# EAGLE schematic PGTNX01_teensy (EAGLE 8.5.2)
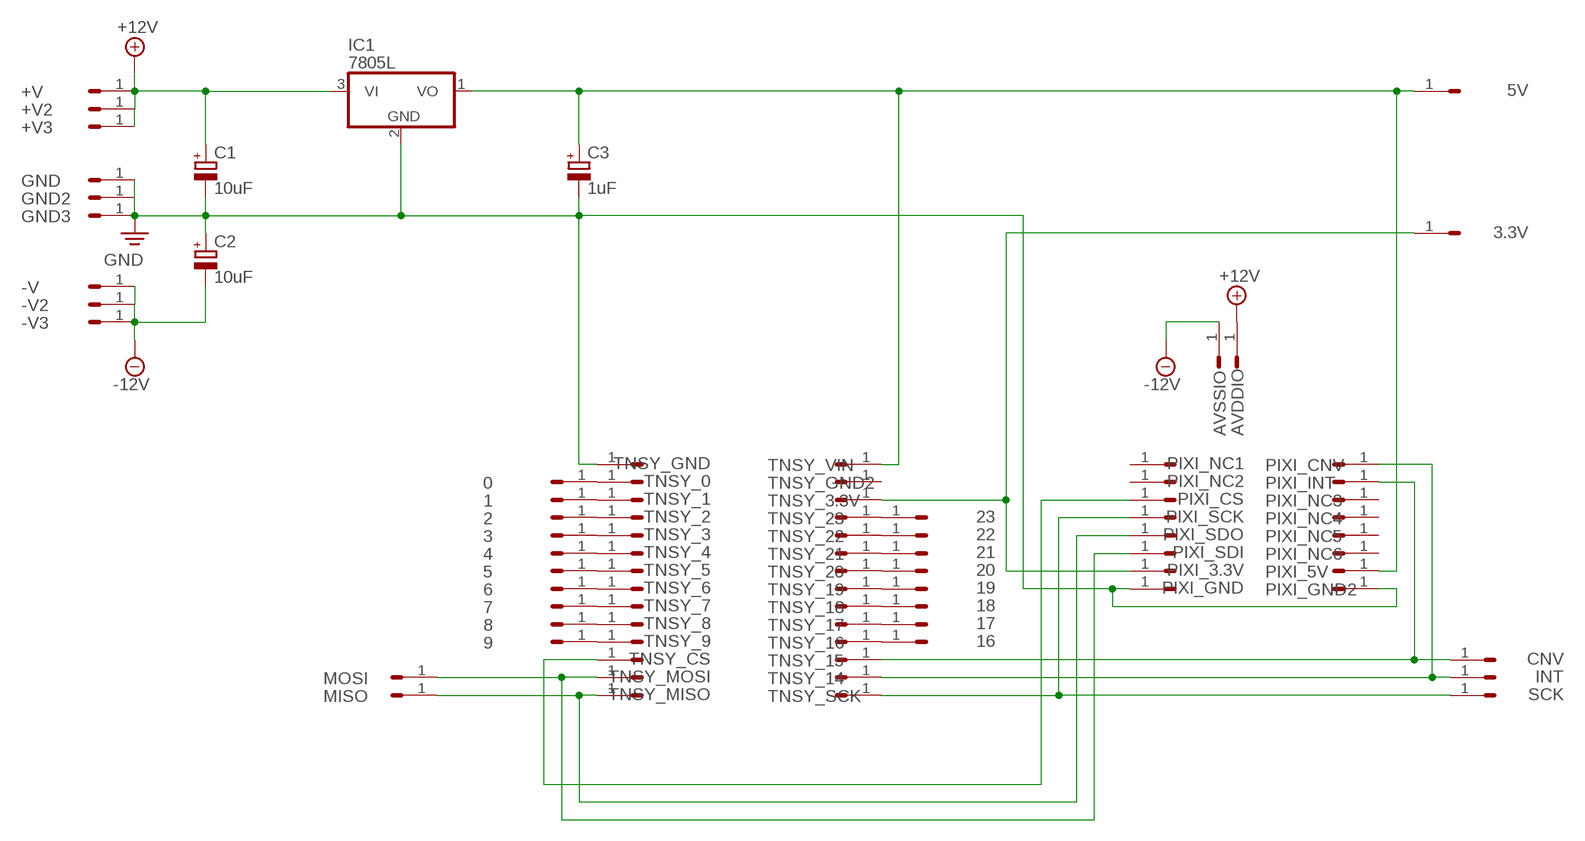
[diagram p0: schematic, sheet 1]

## Parts
0  HEADER/MALE/01  [HEADER/MALE/01]
1  HEADER/MALE/01  [HEADER/MALE/01]
2  HEADER/MALE/01  [HEADER/MALE/01]
3  HEADER/MALE/01  [HEADER/MALE/01]
3.3V  HEADER/MALE/01  [HEADER/MALE/01]
4  HEADER/MALE/01  [HEADER/MALE/01]
5  HEADER/MALE/01  [HEADER/MALE/01]
5V  HEADER/MALE/01  [HEADER/MALE/01]
6  HEADER/MALE/01  [HEADER/MALE/01]
7  HEADER/MALE/01  [HEADER/MALE/01]
8  HEADER/MALE/01  [HEADER/MALE/01]
9  HEADER/MALE/01  [HEADER/MALE/01]
16  HEADER/MALE/01  [HEADER/MALE/01]
17  HEADER/MALE/01  [HEADER/MALE/01]
18  HEADER/MALE/01  [HEADER/MALE/01]
19  HEADER/MALE/01  [HEADER/MALE/01]
20  HEADER/MALE/01  [HEADER/MALE/01]
21  HEADER/MALE/01  [HEADER/MALE/01]
22  HEADER/MALE/01  [HEADER/MALE/01]
23  HEADER/MALE/01  [HEADER/MALE/01]
+V  HEADER/MALE/01  [HEADER/MALE/01]
+V2  HEADER/MALE/01  [HEADER/MALE/01]
+V3  HEADER/MALE/01  [HEADER/MALE/01]
-V  HEADER/MALE/01  [HEADER/MALE/01]
-V2  HEADER/MALE/01  [HEADER/MALE/01]
-V3  HEADER/MALE/01  [HEADER/MALE/01]
AVDDIO  HEADER/MALE/01  [HEADER/MALE/01]
AVSSIO  HEADER/MALE/01  [HEADER/MALE/01]
C1  10uF  CAPACITOR/POLARIZEDE2.5-6  [E2,5-6]
C2  10uF  CAPACITOR/POLARIZEDE2.5-6  [E2,5-6]
C3  1uF  CAPACITOR/POLARIZEDE2.5-6  [E2,5-6]
CNV  HEADER/MALE/01  [HEADER/MALE/01]
GND  HEADER/MALE/01  [HEADER/MALE/01]
GND2  HEADER/MALE/01  [HEADER/MALE/01]
GND3  HEADER/MALE/01  [HEADER/MALE/01]
IC1  7805L  [TO92]
INT  HEADER/MALE/01  [HEADER/MALE/01]
MISO  HEADER/MALE/01  [HEADER/MALE/01]
MOSI  HEADER/MALE/01  [HEADER/MALE/01]
PIXI_3.3V  HEADER/MALE/01  [HEADER/MALE/01]
PIXI_5V  HEADER/MALE/01  [HEADER/MALE/01]
PIXI_CNV  HEADER/MALE/01  [HEADER/MALE/01]
PIXI_CS  HEADER/MALE/01  [HEADER/MALE/01]
PIXI_GND  HEADER/MALE/01  [HEADER/MALE/01]
PIXI_GND2  HEADER/MALE/01  [HEADER/MALE/01]
PIXI_INT  HEADER/MALE/01  [HEADER/MALE/01]
PIXI_NC1  HEADER/MALE/01  [HEADER/MALE/01]
PIXI_NC2  HEADER/MALE/01  [HEADER/MALE/01]
PIXI_NC3  HEADER/MALE/01  [HEADER/MALE/01]
PIXI_NC4  HEADER/MALE/01  [HEADER/MALE/01]
PIXI_NC5  HEADER/MALE/01  [HEADER/MALE/01]
PIXI_NC6  HEADER/MALE/01  [HEADER/MALE/01]
PIXI_SCK  HEADER/MALE/01  [HEADER/MALE/01]
PIXI_SDI  HEADER/MALE/01  [HEADER/MALE/01]
PIXI_SDO  HEADER/MALE/01  [HEADER/MALE/01]
SCK  HEADER/MALE/01  [HEADER/MALE/01]
TNSY_0  HEADER/MALE/01  [HEADER/MALE/01]
TNSY_1  HEADER/MALE/01  [HEADER/MALE/01]
TNSY_2  HEADER/MALE/01  [HEADER/MALE/01]
TNSY_3  HEADER/MALE/01  [HEADER/MALE/01]
TNSY_3.3V  HEADER/MALE/01  [HEADER/MALE/01]
TNSY_4  HEADER/MALE/01  [HEADER/MALE/01]
TNSY_5  HEADER/MALE/01  [HEADER/MALE/01]
TNSY_6  HEADER/MALE/01  [HEADER/MALE/01]
TNSY_7  HEADER/MALE/01  [HEADER/MALE/01]
TNSY_8  HEADER/MALE/01  [HEADER/MALE/01]
TNSY_9  HEADER/MALE/01  [HEADER/MALE/01]
TNSY_14  HEADER/MALE/01  [HEADER/MALE/01]
TNSY_15  HEADER/MALE/01  [HEADER/MALE/01]
TNSY_16  HEADER/MALE/01  [HEADER/MALE/01]
TNSY_17  HEADER/MALE/01  [HEADER/MALE/01]
TNSY_18  HEADER/MALE/01  [HEADER/MALE/01]
TNSY_19  HEADER/MALE/01  [HEADER/MALE/01]
TNSY_20  HEADER/MALE/01  [HEADER/MALE/01]
TNSY_21  HEADER/MALE/01  [HEADER/MALE/01]
TNSY_22  HEADER/MALE/01  [HEADER/MALE/01]
TNSY_23  HEADER/MALE/01  [HEADER/MALE/01]
TNSY_CS  HEADER/MALE/01  [HEADER/MALE/01]
TNSY_GND  HEADER/MALE/01  [HEADER/MALE/01]
TNSY_GND2  HEADER/MALE/01  [HEADER/MALE/01]
TNSY_MISO  HEADER/MALE/01  [HEADER/MALE/01]
TNSY_MOSI  HEADER/MALE/01  [HEADER/MALE/01]
TNSY_SCK  HEADER/MALE/01  [HEADER/MALE/01]
TNSY_VIN  HEADER/MALE/01  [HEADER/MALE/01]

## Nets
+12V: +V2.1 +V3.1 +V.1 AVDDIO.1 C1.+ IC1.3(VI)
-12V: -V2.1 -V3.1 -V.1 AVSSIO.1 C2.-
GND: C1.- C2.+ C3.- GND2.1 GND3.1 GND.1 IC1.2(GND) PIXI_GND2.1 PIXI_GND.1 TNSY_GND.1
N$1: 5V.1 C3.+ IC1.1(VO) PIXI_5V.1 TNSY_VIN.1
N$2: 17.1 TNSY_17.1
N$3: 3.3V.1 PIXI_3.3V.1 TNSY_3.3V.1
N$4: 16.1 TNSY_16.1
N$5: MOSI.1 PIXI_SDI.1 TNSY_MOSI.1
N$6: MISO.1 PIXI_SDO.1 TNSY_MISO.1
N$7: PIXI_SCK.1 SCK.1 TNSY_SCK.1
N$8: PIXI_CS.1 TNSY_CS.1
N$9: INT.1 PIXI_CNV.1 TNSY_14.1
N$10: CNV.1 PIXI_INT.1 TNSY_15.1
N$11: 18.1 TNSY_18.1
N$12: 19.1 TNSY_19.1
N$13: 20.1 TNSY_20.1
N$14: 21.1 TNSY_21.1
N$15: 22.1 TNSY_22.1
N$16: 23.1 TNSY_23.1
N$17: 0.1 TNSY_0.1
N$18: 1.1 TNSY_1.1
N$19: 2.1 TNSY_2.1
N$20: 3.1 TNSY_3.1
N$21: 4.1 TNSY_4.1
N$22: 5.1 TNSY_5.1
N$23: 6.1 TNSY_6.1
N$24: 7.1 TNSY_7.1
N$25: 8.1 TNSY_8.1
N$26: 9.1 TNSY_9.1
Unconnected: PIXI_NC1.1 PIXI_NC2.1 PIXI_NC3.1 PIXI_NC4.1 PIXI_NC5.1 PIXI_NC6.1 TNSY_GND2.1

## Library data of the parts
0 1-3 3.3V 4 5 5V 6-9 16-23 +V +V2 +V3 -V -V2 -V3 AVDDIO AVSSIO CNV GND GND2 GND3 INT MISO MOSI PIXI_3.3V PIXI_5V PIXI_CNV PIXI_CS PIXI_GND PIXI_GND2 PIXI_INT PIXI_NC1-PIXI_NC6 PIXI_SCK PIXI_SDI PIXI_SDO SCK TNSY_0 TNSY_1-TNSY_3 TNSY_3.3V TNSY_4-TNSY_9 TNSY_14-TNSY_23 TNSY_CS TNSY_GND TNSY_GND2 TNSY_MISO TNSY_MOSI TNSY_SCK TNSY_VIN = connectors:HEADER/MALE/01; SPICEPREFIX: X
C1-C3 = capacitors:CAPACITOR/POLARIZED: POLARIZED CAPACITOR, European symbol; SPICEPREFIX: C
IC1 = ic_voltage_reg:78*: Positive VOLTAGE REGULATOR Source: http://cache.national.com/ds/LM/LM78L05.pdf http://www.fairchildsemi.com/ds/LM/LM7805.pdf